# Altium schematic sheet MainBoard.SchDoc
size A4; SheetNumber: 1; SheetTotal: 1
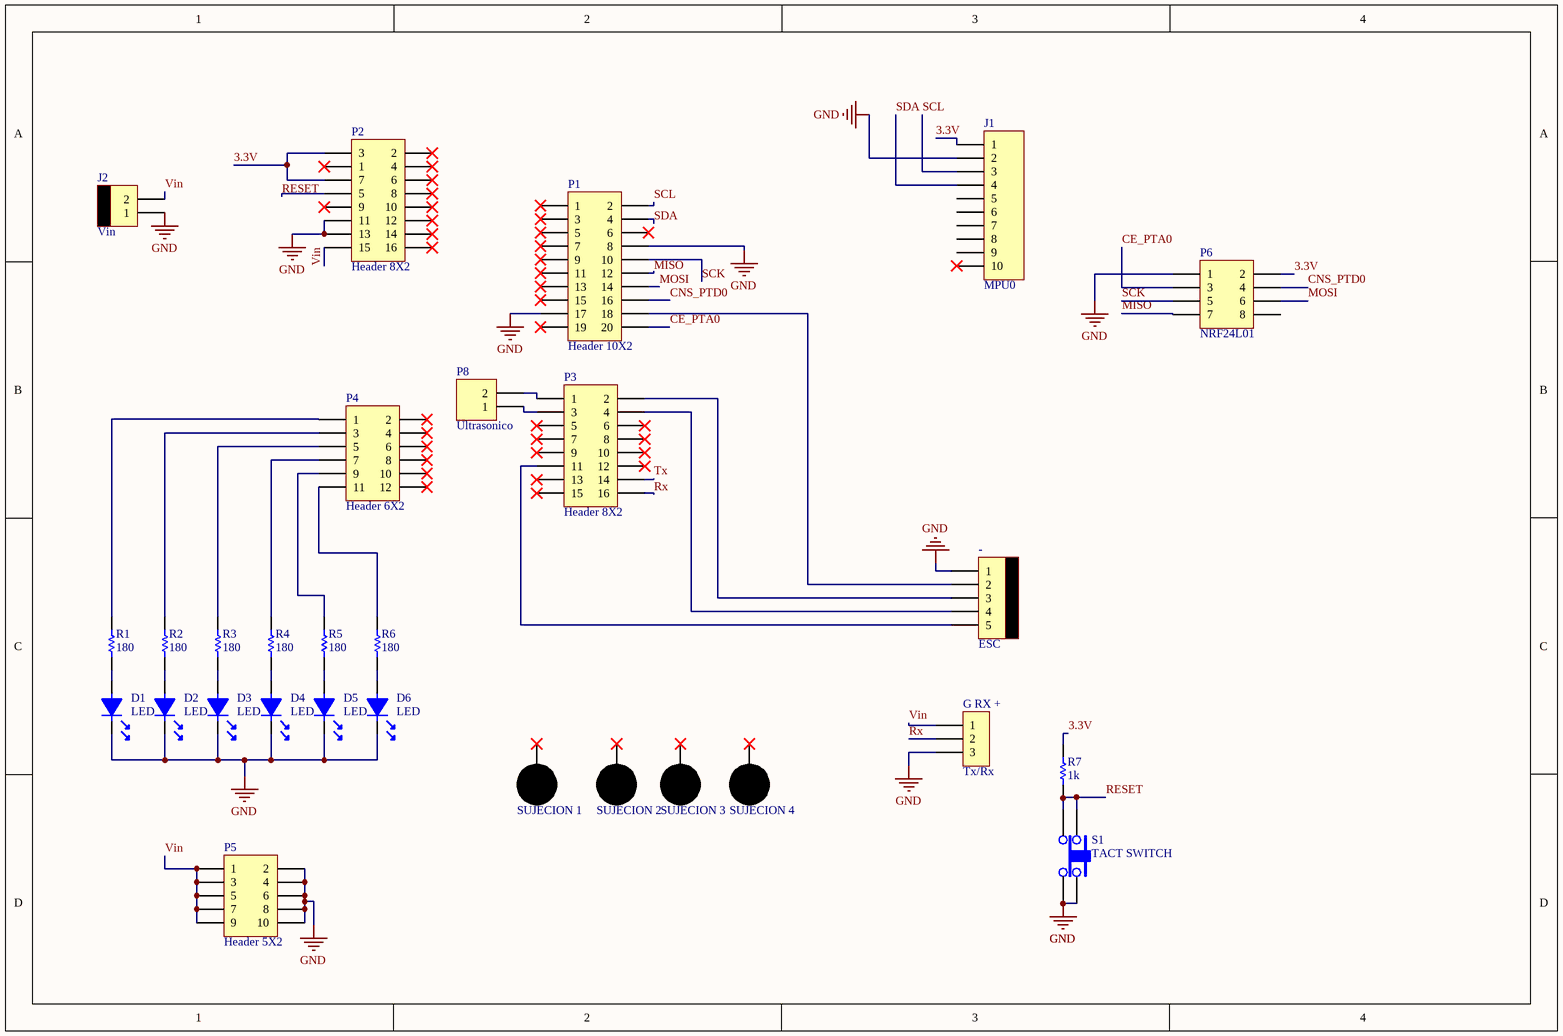
[diagram p0: MainBoard.SchDoc]

## Parts
-  ESC  [MOLEX5]
D1  LED  [LED3]
D2  LED  [LED3]
D3  LED  [LED3]
D4  LED  [LED3]
D5  LED  [LED3]
D6  LED  [LED3]
G_RX_+  Tx/Rx  [SIP3]
J1  MPU0  [SIP10]
J2  Vin  [MOLEX2]
P1  Header 10X2  [HDR2X10]
P2  Header 8X2  [HDR2X8]
P3  Header 8X2  [HDR2X8]
P4  Header 6X2  [HDR2X6]
P5  Header 5X2  [HDR2X5]
P6  NRF24L01  [HDR2X4]
P8  Ultrasonico  [HDR1X2]
R1  180  [RES400]
R2  180  [RES400]
R3  180  [RES400]
R4  180  [RES400]
R5  180  [RES400]
R6  180  [RES400]
R7  1k  [RES400]
S1  TACT SWITCH  [TACTSWITCH]
SUJECION_1  SUJECION  [SUJECION (5.00MM - 3.50MM)]  (value not drawn)
SUJECION_2  SUJECION  [SUJECION (5.00MM - 3.50MM)]  (value not drawn)
SUJECION_3  SUJECION  [SUJECION (5.00MM - 3.50MM)]  (value not drawn)
SUJECION_4  SUJECION  [SUJECION (5.00MM - 3.50MM)]  (value not drawn)

## Nets
GND: -.1 D1.2 D2.2 D3.2 D4.2 D5.2 D6.2 G_RX_+.3 J1.2 J2.1 P1.8 P1.17 P2.11 P2.13 P5.2 P5.4 P5.6 P5.8 P5.10 P6.1 S1.3 S1.4
3.3V: J1.1 P2.3 P2.7 P6.2 R7.2
CE_PTA0: P1.20 P6.3
CNS_PTD0: P1.16 P6.4
MISO: P1.12 P6.7
MOSI: P1.14 P6.6
RESET: P2.5 R7.1 S1.1 S1.2
Rx: G_RX_+.2 P3.16
SCK: P1.10 P6.5
SCL: J1.3 P1.2
SDA: J1.4 P1.4
Tx: P3.14
Vin: G_RX_+.1 J2.2 P2.15 P5.1 P5.3 P5.5 P5.7 P5.9
Net-_2: -.2 P1.18
Net-_3: -.3 P3.2
Net-_4: -.4 P3.4
Net-_5: -.5 P3.11
NetD1_1: D1.1 R1.2
NetD2_1: D2.1 R2.2
NetD3_1: D3.1 R3.2
NetD4_1: D4.1 R4.2
NetD5_1: D5.1 R5.2
NetD6_1: D6.1 R6.2
NetP3_1: P3.1 P8.2
NetP3_3: P3.3 P8.1
NetP4_1: P4.1 R1.1
NetP4_3: P4.3 R2.1
NetP4_5: P4.5 R3.1
NetP4_7: P4.7 R4.1
NetP4_9: P4.9 R5.1
NetP4_11: P4.11 R6.1

Not connected (* = marked no-connect by the designer): J1 5 6 7 8 9 10*; P1 1* 3* 5* 6* 7* 9* 11* 13* 15* 19*; P2 1* 2* 4* 6* 8* 9* 10* 12* 14* 16*; P3 5* 6* 7* 8* 9* 10* 12* 13* 15*; P4 2* 4* 6* 8* 10* 12*; P6 8; SUJECION_1 1*; SUJECION_2 1*; SUJECION_3 1*; SUJECION_4 1*

## Library data of the parts
- = MOLEX5
G_RX_+ = CON3
J1 = CON10
J2 = MOLEX2
P1 = Header 10X2: Header, 10-Pin, Dual row; LatestRevisionDate: 17-Jul-2002; LatestRevisionNote: Re-released for DXP Platform.; Publisher: Altium Limited
P2 P3 = Header 8X2: Header, 8-Pin, Dual row; LatestRevisionDate: 17-Jul-2002; LatestRevisionNote: Re-released for DXP Platform.; Publisher: Altium Limited
P4 = Header 6X2: Header, 6-Pin, Dual row; LatestRevisionDate: 17-Jul-2002; LatestRevisionNote: Re-released for DXP Platform.; Publisher: Altium Limited
P5 = Header 5X2: Header, 5-Pin, Dual row; LatestRevisionDate: 17-Jul-2002; LatestRevisionNote: Re-released for DXP Platform.; Publisher: Altium Limited
P6 = Header 4X2: Header, 4-Pin, Dual row; LatestRevisionDate: 17-Jul-2002; LatestRevisionNote: Re-released for DXP Platform.; Publisher: Altium Limited
P8 = Header 2: Header, 2-Pin; LatestRevisionDate: 17-Jul-2002; LatestRevisionNote: Re-released for DXP Platform.; Publisher: Altium Limited
R1-R7 = RES